# EAGLE design MegaShield (EAGLE 5.11)
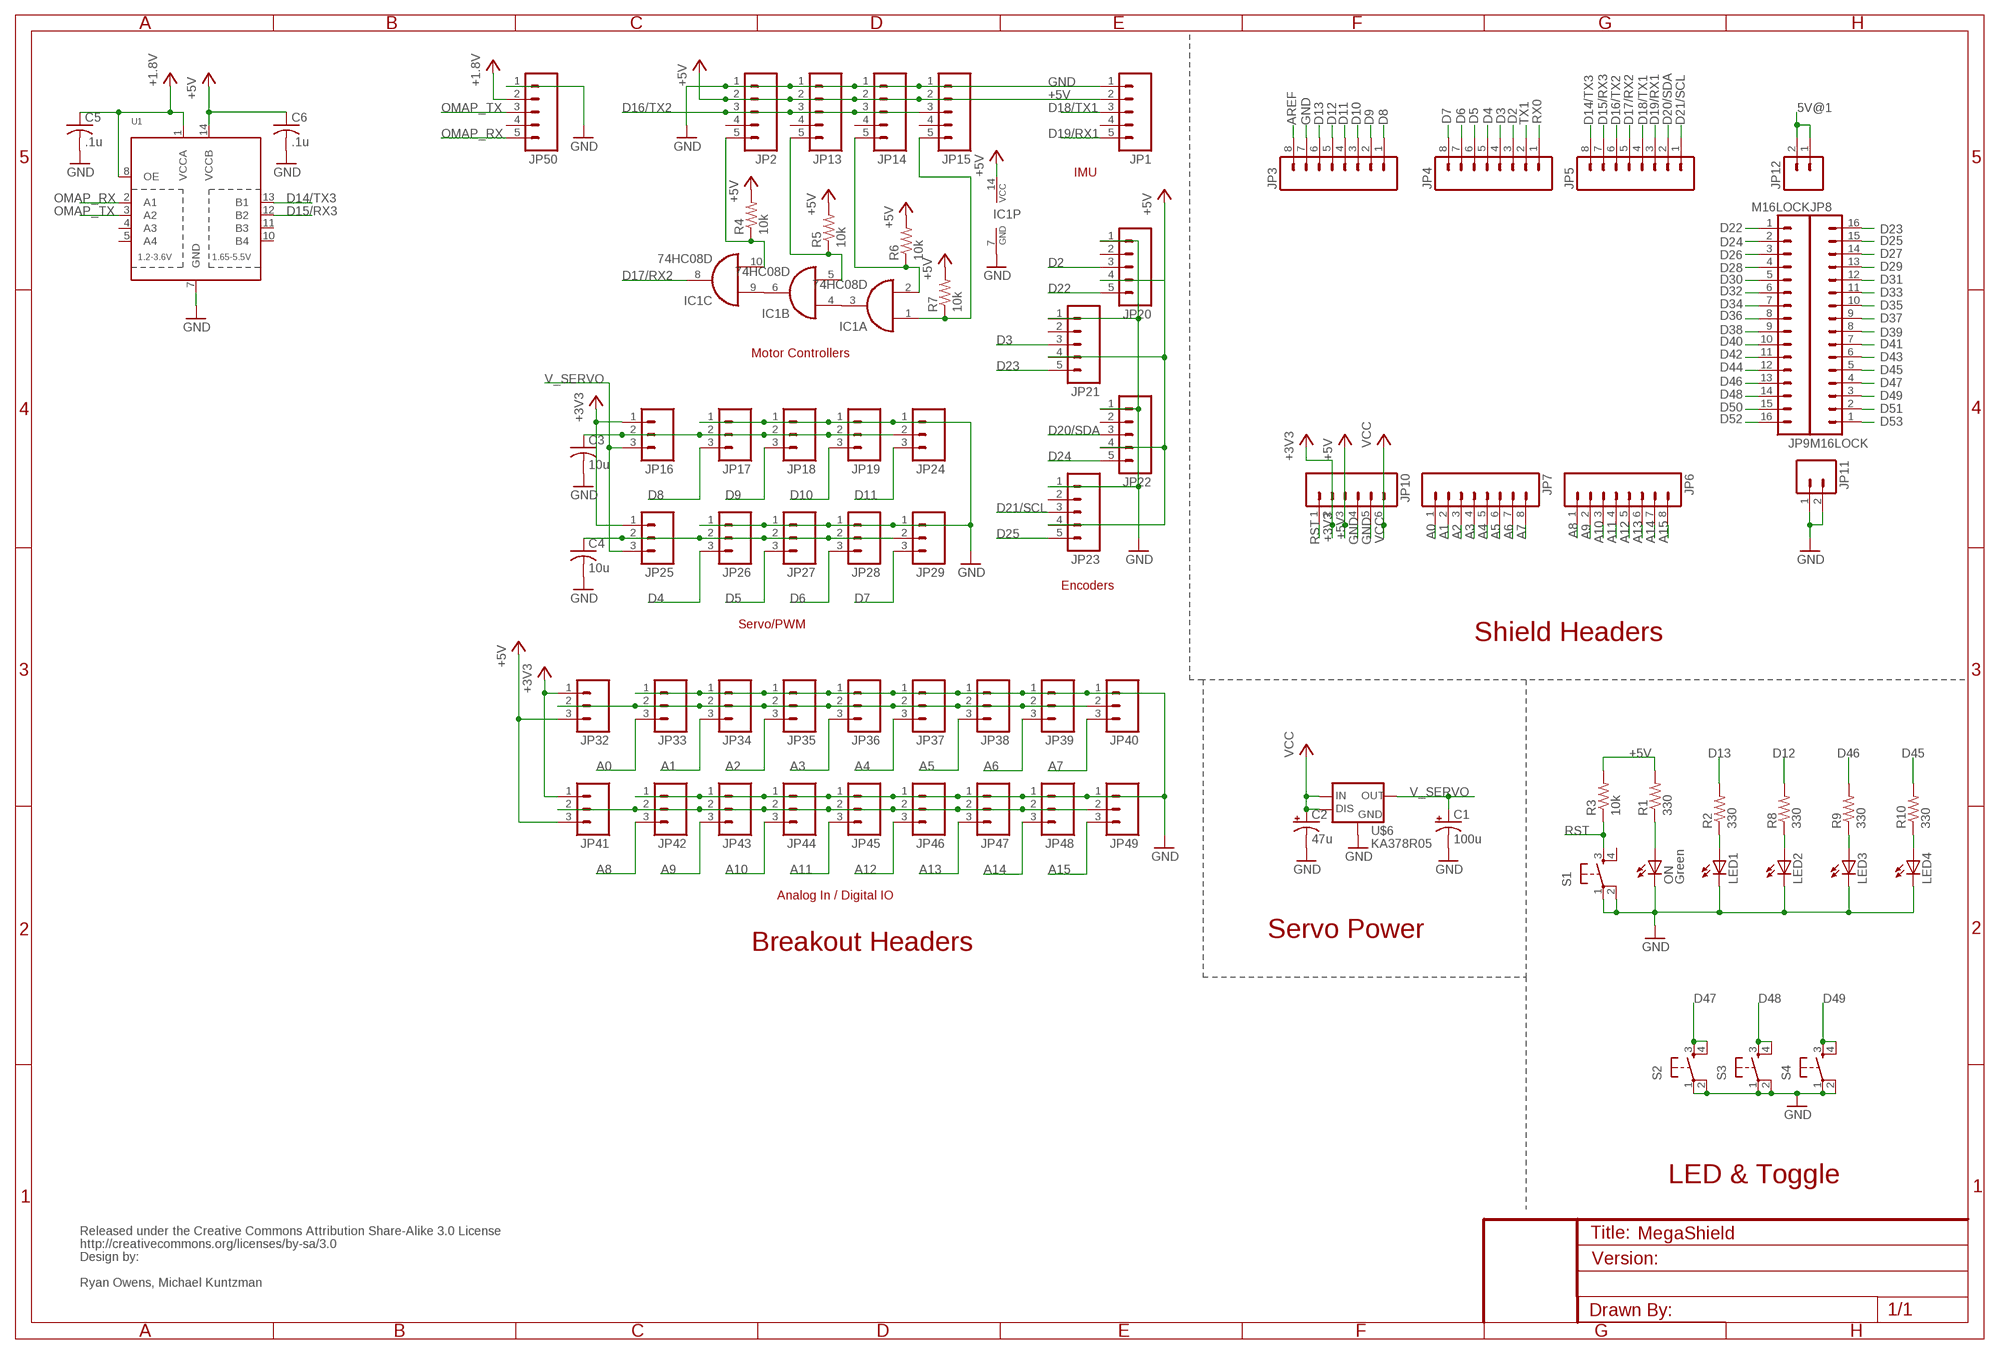
[diagram p0: schematic, sheet 1]

## Parts
C1  100u  CPOL-USC  [PANASONIC_C]
C2  47u  CPOL-USC  [PANASONIC_C]
C3  10u  C-USC0805  [C0805]
C4  10u  C-USC0805  [C0805]
C5  .1u  C-USC0805  [C0805]
C6  .1u  C-USC0805  [C0805]
IC1  74HC08D  [SO14]
JP1  M05LOCK  [1X05_LOCK]
JP2  M05PTH  [1X05]
JP3  M08LOCK  [1X08_LOCK]
JP4  M08LOCK  [1X08_LOCK]
JP5  M08LOCK  [1X08_LOCK]
JP6  M08LOCK  [1X08_LOCK]
JP7  M08LOCK  [1X08_LOCK]
JP8  M16LOCK  [1X16_LOCK]
JP9  M16LOCK  [1X16_LOCK]
JP10  M06LOCK  [1X06_LOCK]
JP11  M02LOCK  [1X02_LOCK]
JP12  M02LOCK  [1X02_LOCK]
JP13  M05PTH  [1X05]
JP14  M05PTH  [1X05]
JP15  M05PTH  [1X05]
JP16  M03PTH  [1X03]
JP17  M03PTH  [1X03]
JP18  M03PTH  [1X03]
JP19  M03PTH  [1X03]
JP20  M05PTH  [1X05]
JP21  M05PTH  [1X05]
JP22  M05PTH  [1X05]
JP23  M05PTH  [1X05]
JP24  M03PTH  [1X03]
JP25  M03PTH  [1X03]
JP26  M03PTH  [1X03]
JP27  M03PTH  [1X03]
JP28  M03PTH  [1X03]
JP29  M03PTH  [1X03]
JP32  M03PTH  [1X03]
JP33  M03PTH  [1X03]
JP34  M03PTH  [1X03]
JP35  M03PTH  [1X03]
JP36  M03PTH  [1X03]
JP37  M03PTH  [1X03]
JP38  M03PTH  [1X03]
JP39  M03PTH  [1X03]
JP40  M03PTH  [1X03]
JP41  M03PTH  [1X03]
JP42  M03PTH  [1X03]
JP43  M03PTH  [1X03]
JP44  M03PTH  [1X03]
JP45  M03PTH  [1X03]
JP46  M03PTH  [1X03]
JP47  M03PTH  [1X03]
JP48  M03PTH  [1X03]
JP49  M03PTH  [1X03]
JP50  M05LOCK  [1X05_LOCK]
LED1  LED0603  [LED-0603]
LED2  LED0603  [LED-0603]
LED3  LED0603  [LED-0603]
LED4  LED0603  [LED-0603]
ON  Green  LED0603  [LED-0603]
R1  330  R-US_R0805  [R0805]
R2  330  R-US_R0805  [R0805]
R3  10k  R-US_R0805  [R0805]
R4  10k  R-US_R0805  [R0805]
R5  10k  R-US_R0805  [R0805]
R6  10k  R-US_R0805  [R0805]
R7  10k  R-US_R0805  [R0805]
R8  330  R-US_R0805  [R0805]
R9  330  R-US_R0805  [R0805]
R10  330  R-US_R0805  [R0805]
S1  TAC_SWITCHPTH  [TACTILE-PTH]
S2  TAC_SWITCHPTH  [TACTILE-PTH]
S3  TAC_SWITCHPTH  [TACTILE-PTH]
S4  TAC_SWITCHPTH  [TACTILE-PTH]
U1  TXB0104PWR  [TSSOP14]
U$2  CREATIVE_COMMONS  [CREATIVE_COMMONS]
U$6  KA378R05  [KA378]

## Nets
5V@1: JP12.1 JP12.2
+1V8: C5.1 JP50.2 U1.1(VCCA) U1.8(OE) ; supply symbol labelled +1.8V
+3.3V: C6.1 U1.14(VCCB) ; supply symbol labelled +5V
+3V3 [power]: JP10.2 JP16.1 JP25.1 JP32.1 JP41.1
+5V [power]: IC1.14(P:VCC) JP1.2 JP2.2 JP10.3 JP13.2 JP14.2 JP15.2 JP20.4 JP21.4 JP22.4 JP23.4 JP32.3 JP41.3 R1.2 R3.2 R4.2 R5.2 R6.2 R7.2
A0: JP7.1 JP33.3
A1: JP7.2 JP34.3
A2: JP7.3 JP35.3
A3: JP7.4 JP36.3
A4: JP7.5 JP37.3
A5: JP7.6 JP38.3
A6: JP7.7 JP39.3
A7: JP7.8 JP40.3
A8: JP6.1 JP42.3
A9: JP6.2 JP43.3
A10: JP6.3 JP44.3
A11: JP6.4 JP45.3
A12: JP6.5 JP46.3
A13: JP6.6 JP47.3
A14: JP6.7 JP48.3
A15: JP6.8 JP49.3
AREF: JP3.8
D2: JP4.3 JP20.3
D3: JP4.4 JP21.3
D4: JP4.5 JP26.3
D5: JP4.6 JP27.3
D6: JP4.7 JP28.3
D7: JP4.8 JP29.3
D8: JP3.1 JP17.3
D9: JP3.2 JP18.3
D10: JP3.3 JP19.3
D11: JP3.4 JP24.3
D12: JP3.5 R8.2
D13: JP3.6 R2.2
D14/TX3: JP5.8 U1.13(B1)
D15/RX3: JP5.7 U1.12(B2)
D16/TX2: JP2.3 JP5.6 JP13.3 JP14.3 JP15.3
D17/RX2: IC1.8(C:O) JP5.5
D18/TX1: JP1.3 JP5.4
D19/RX1: JP1.5 JP5.3
D20/SDA: JP5.2 JP22.3
D21/SCL: JP5.1 JP23.3
D22: JP9.1 JP20.5
D23: JP8.16 JP21.5
D24: JP9.2 JP22.5
D25: JP8.15 JP23.5
D26: JP9.3
D27: JP8.14
D28: JP9.4
D29: JP8.13
D30: JP9.5
D31: JP8.12
D32: JP9.6
D33: JP8.11
D34: JP9.7
D35: JP8.10
D36: JP9.8
D37: JP8.9
D38: JP9.9
D39: JP8.8
D40: JP9.10
D41: JP8.7
D42: JP9.11
D43: JP8.6
D44: JP9.12
D45: JP8.5 R10.2
D46: JP9.13 R9.2
D47: JP8.4 S2.3 S2.4
D48: JP9.14 S3.3 S3.4
D49: JP8.3 S4.3 S4.4
D50: JP9.15
D51: JP8.2
D52: JP9.16
D53: JP8.1
GND [power]: C1.- C2.- C3.2 C4.2 C5.2 C6.2 IC1.7(P:GND) JP1.1 JP2.1 JP3.7 JP10.4 JP10.5 JP11.1 JP11.2 JP13.1 JP14.1 JP15.1 JP17.1 JP18.1 JP19.1 JP20.1 JP21.1 JP22.1 JP23.1 JP24.1 JP26.1 JP27.1 JP28.1 JP29.1 JP33.1 JP34.1 JP35.1 JP36.1 JP37.1 JP38.1 JP39.1 JP40.1 JP42.1 JP43.1 JP44.1 JP45.1 JP46.1 JP47.1 JP48.1 JP49.1 JP50.1 LED1.C LED2.C LED3.C LED4.C ON.C S1.1 S1.2 S2.1 S2.2 S3.1 S3.2 S4.1 S4.2 U1.7(GND) U$6.GND
N$1: LED2.A R8.1
N$2: C3.1 JP16.2 JP17.2 JP18.2 JP19.2 JP24.2
N$3: C4.1 JP25.2 JP26.2 JP27.2 JP28.2 JP29.2
N$4: IC1.3(A:O) IC1.4(B:I0)
N$5: IC1.6(B:O) IC1.9(C:I0)
N$6: IC1.1(A:I0) JP15.5 R7.1
N$7: IC1.2(A:I1) JP14.5 R6.1
N$8: IC1.5(B:I1) JP13.5 R5.1
N$9: IC1.10(C:I1) JP2.5 R4.1
N$10: JP41.2 JP42.2 JP43.2 JP44.2 JP45.2 JP46.2 JP47.2 JP48.2 JP49.2
N$11: JP32.2 JP33.2 JP34.2 JP35.2 JP36.2 JP37.2 JP38.2 JP39.2 JP40.2
N$12: LED3.A R9.1
N$13: LED4.A R10.1
N$126: ON.A R1.1
N$127: LED1.A R2.1
OMAP_RX: JP50.5 U1.2(A1)
OMAP_TX: JP50.3 U1.3(A2)
RST: JP10.1 R3.1 S1.3
RX0: JP4.1
TX1: JP4.2
V_SERVO [power]: C1.+ JP16.3 JP25.3 U$6.OUT
VCC [power]: C2.+ JP10.6 U$6.DIS U$6.IN
Unconnected: IC1.11(D:O) IC1.12(D:I0) IC1.13(D:I1) JP1.4 JP2.4 JP13.4 JP14.4 JP15.4 JP20.2 JP21.2 JP22.2 JP23.2 JP50.4 S1.4 U1.4(A3) U1.5(A4) U1.10(B4) U1.11(B3)

## Notes on the sheet
- IMU
- Motor Controllers
- Encoders
- Servo/PWM
- Shield Headers
- Analog In / Digital IO
- Servo Power
- Breakout Headers
- LED & Toggle
- Ryan Owens, Michael Kuntzman

## Library data of the parts
C1 C2 = resistor:CPOL-US: POLARIZED CAPACITOR, American symbol
C3-C6 = resistor:C-US: CAPACITOR, American symbol
IC1 = 74xx-eu:74*08: Quad 2-input AND gate
JP1 JP2 JP13-JP15 JP20-JP23 JP50 = SparkFun:M05: Header 5 Standard 5-pin 0.1" header. Use with straight break away headers (SKU : PRT-00116), right angle break away headers (PRT-00553), swiss pins (PRT-00743), machine pins (PRT-00117), and female headers (PRT-00115). Molex polarized connector foot print use with SKU : PRT-08230 with associated crimp pins and housings.
JP3-JP7 = SparkFun:M08: Header 8 Standard 8-pin 0.1" header. Use with straight break away headers (SKU : PRT-00116), right angle break away headers (PRT-00553), swiss pins (PRT-00743), machine pins (PRT-00117), and female headers (PRT-00115).
JP8 JP9 = SparkFun:M16
JP10 = SparkFun:M06: Header 6 Standard 6-pin 0.1" header. Use with straight break away headers (SKU : PRT-00116), right angle break away headers (PRT-00553), swiss pins (PRT-00743), machine pins (PRT-00117), and female headers (PRT-00115). Molex polarized connector foot print use with SKU : PRT-08094 with associated crimp pins and housings. NOTES ON THE VARIANTS LOCK and LOCK_LONGPADS... This footprint was designed to help hold the alignment of a through-hole component (i.e. 6-pin header) while soldering it into place. You may notice that each hole has been shifted either up or down by 0.005 of an inch from it's more standard position (which is a perfectly straight line). This slight alteration caused the pins (the squares in the middle) to touch the edges of the holes. Because they are alternating, it causes a "brace" to hold the component in place. 0.005 has proven to be the perfect amount of "off-center" position when using our standard breakaway headers. Although looks a little odd when you look at the bare footprint, once you have a header in there, the alteration is very hard to notice. Also, if you push a header all the way into place, it is covered up entirely on the bottom side. This idea of altering the position of holes to aid alignment will be further integrated into the Sparkfun Library for other footprints. It can help hold any component with 3 or more connection pins.
JP11 JP12 = SparkFun:M02: Header 2 Standard 2-pin 0.1" header. Use with straight break away headers (SKU : PRT-00116), right angle break away headers (PRT-00553), swiss pins (PRT-00743), machine pins (PRT-00117), and female headers (PRT-00115). Molex polarized connector foot print use with SKU : PRT-08233 with associated crimp pins and housings.
JP16-JP19 JP24-JP29 JP32-JP49 = SparkFun:M03: Header 3 Standard 3-pin 0.1" header. Use with straight break away headers (SKU : PRT-00116), right angle break away headers (PRT-00553), swiss pins (PRT-00743), machine pins (PRT-00117), and female headers (PRT-00115). Molex polarized connector foot print use with SKU : PRT-08232 with associated crimp pins and housings.
LED1-LED4 ON = SparkFun:LED: LEDs Standard schematic elements and footprints for 5mm, 3mm, 1206, and 0603 sized LEDs. 5mm - Spark Fun Electronics SKU : COM-00529 (and others)
R1-R10 = resistor:R-US_: RESISTOR, American symbol
S1-S4 = SparkFun:TAC_SWITCH: Momentary Switch Button commonly used for reset or general input. Spark Fun Electronics SKU : COM-00097
U1 = adafruit:TXB0104PWR: 4-Bit Bi-Directional Level Shifter 1.2V-3.6V (VCCA) to 1.65V-5.5V (VCCB) bi-directional level shifter with auto direction sensing. Max data rate - VCCA 1.8V: 20Mbps (50ns), VCCA 3.3V: 100Mbps (10ns) Digikey: 296-21929-1-ND
U$2 = SparkFun:CREATIVE_COMMONS
U$6 = ee192:KA378R05

## Board
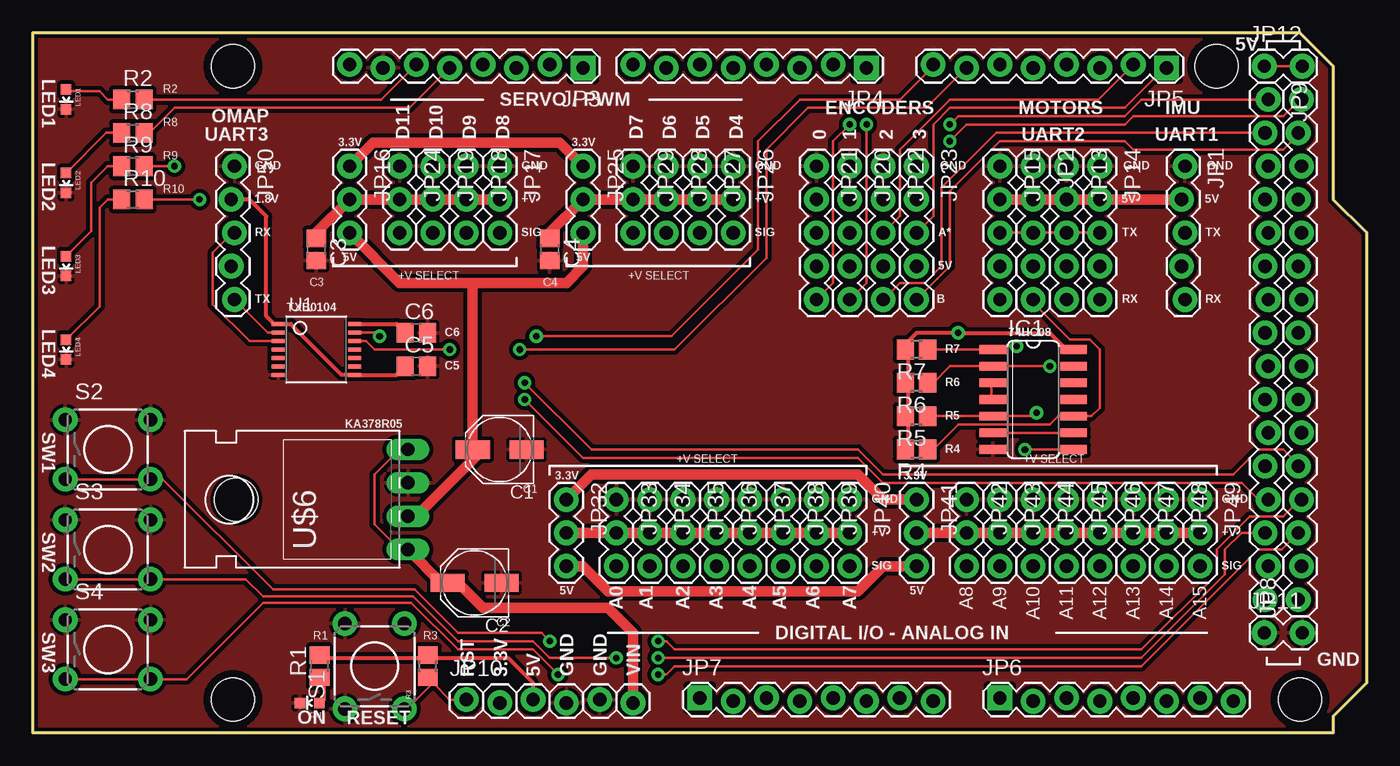
[diagram p1: board, top side]
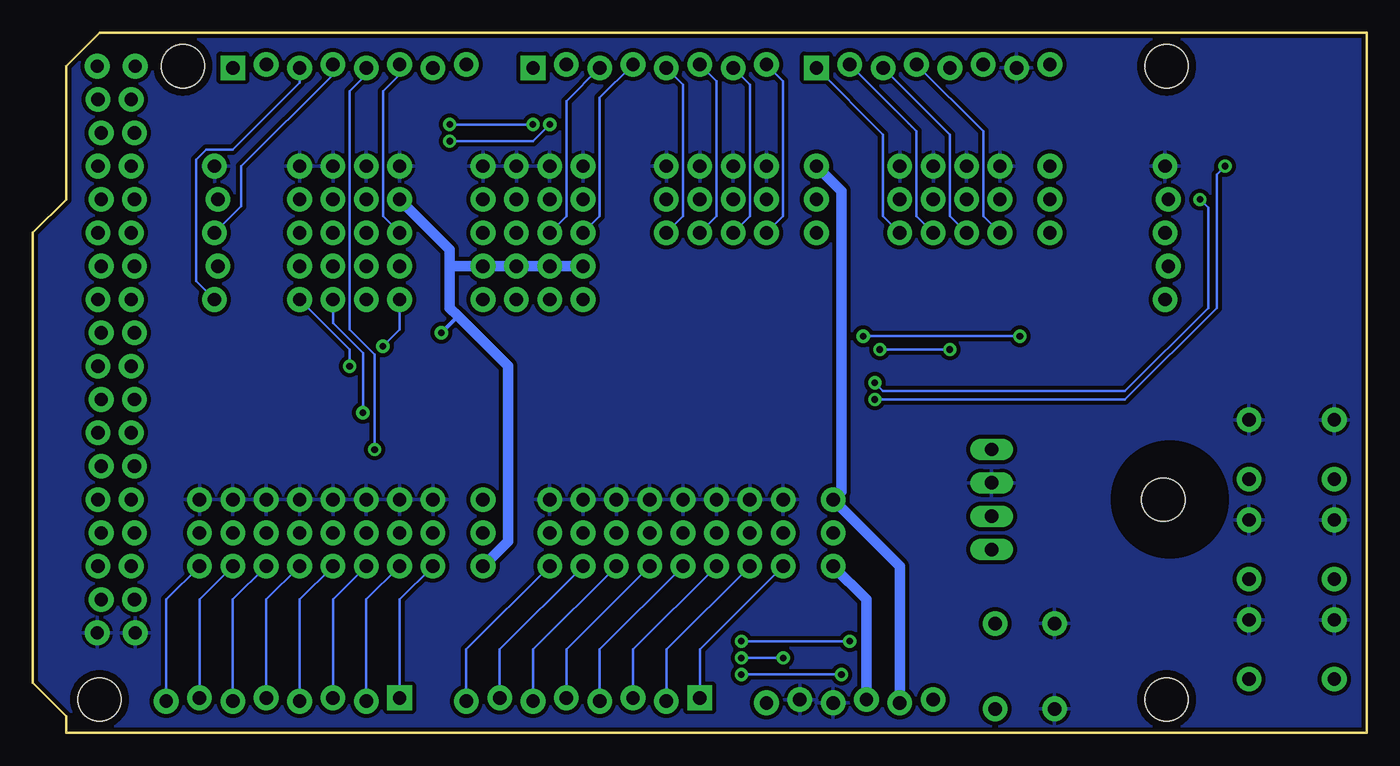
[diagram p2: board, bottom side, seen from below]

Size 101.6 x 53.34 mm. Coordinates in mm from the lower left corner, seen from the top.
Outline: 0,0 99.06,0 99.06,1.27 101.6,3.81 101.6,38.1 99.06,40.64 99.06,50.8 96.52,53.34 0,53.34 0,0
Copper layers (1*16): Top 0.035mm / dielectric 1.5mm / Bottom 0.035mm
Design rules "SparkFun *": minimum track width 8mil, minimum drill 15mil, track to track 8mil, track to pad 8mil, pad to pad 8mil, via to via 8mil, smd to smd 8mil, copper to edge 8mil, drill to drill 8mil, minimum pad ring 12mil, minimum via ring 10mil, stop-mask expansion 4mil, vias tented up to drill 25mil, thermal gap 10mil

### Footprints (pad centres in the part's own frame; a part is rotated, then mirrored left to right if it is on the bottom)
PANASONIC_C = smd 2.6 x 1.4: + 2.05,0; - -2.05,0
C0805 = smd 1.3 x 1.5: 1 -0.85,0; 2 0.85,0
SO14 = smd 0.66 x 2.032: 1 -3.81,-3.073; 2 -2.54,-3.073; 3 -1.27,-3.073; 4 0,-3.073; 5 1.27,-3.073; 6 2.54,-3.073; 7 3.81,-3.073; 8 3.81,3.073; 9 2.54,3.073; 10 1.27,3.073; 11 0,3.073; 12 -1.27,3.073; 13 -2.54,3.073; 14 -3.81,3.073
1X05_LOCK = drill 1.016 pad 1.88 round: 1 0,0.127; 2 2.54,-0.127; 3 5.08,0.127; 4 7.62,-0.127; 5 10.16,0.127
1X05 = drill 1.016 pad 1.88 round: 1 0,0; 2 2.54,0; 3 5.08,0; 4 7.62,0; 5 10.16,0
1X08_LOCK = drill 1.016 pad 1.88 square: 1 0,0.127 | drill 1.016 pad 1.88 round: 2 2.54,-0.127; 3 5.08,0.127; 4 7.62,-0.127; 5 10.16,0.127; 6 12.7,-0.127; 7 15.24,0.127; 8 17.78,-0.127
1X16_LOCK = drill 1.016 pad 1.88 round: 1 0,0.127; 2 2.54,-0.127; 3 5.08,0.127; 4 7.62,-0.127; 5 10.16,0.127; 6 12.7,-0.127; 7 15.24,0.127; 8 17.78,-0.127; 9 20.32,0.127; 10 22.86,-0.127; 11 25.4,0.127; 12 27.94,-0.127; 13 30.48,0.127; 14 33.02,-0.127; 15 35.56,0.127; 16 38.1,-0.127
1X06_LOCK = drill 1.016 pad 1.88 round: 1 0,0; 2 2.54,-0.254; 3 5.08,0; 4 7.62,-0.254; 5 10.16,0; 6 12.7,-0.254
1X02_LOCK = drill 1.016 pad 1.88 round: 1 -0.178,0; 2 2.718,0
1X03 = drill 1.016 pad 1.88 round: 1 0,0; 2 2.54,0; 3 5.08,0
LED-0603 = smd 0.8 x 0.8: A 0,-0.75; C 0,0.75
R0805 = smd 1.3 x 1.5: 1 -0.85,0; 2 0.85,0
TACTILE-PTH = drill 1.016 pad 1.88 round: 1 -3.251,2.261; 2 3.251,2.261; 3 -3.251,-2.261; 4 3.251,-2.261
TSSOP14 = smd 0.305 x 0.991: 1 -1.95,-2.918; 2 -1.3,-2.918; 3 -0.65,-2.918; 4 0,-2.918; 5 0.65,-2.918; 6 1.3,-2.918; 7 1.95,-2.918; 8 1.95,2.918; 9 1.3,2.918; 10 0.65,2.918; 11 0,2.918; 12 -0.65,2.918; 13 -1.3,2.918; 14 -1.95,2.918
STAND-OFF = hole 3.302: 0,0
KA378 = drill 1.016 long: DIS 3.81,-1.905; GND 1.27,-1.905; IN -3.81,-1.905; OUT -1.27,-1.905 | hole 3.302: 0,11.176

### Placement (x,y rotation side)
C1  35.56,21.59 180 top
C2  33.66,11.43 180 top
C3  21.59,36.83 270 top
C4  39.37,36.83 270 top
C5  29.21,27.94 0 top
C6  29.21,30.48 0 top
IC1  76.2,25.4 270 top
JP1  87.63,43.18 270 top
JP2  76.2,43.18 270 top
JP3  41.91,50.8 180 top
JP4  63.5,50.8 180 top
JP5  86.36,50.8 180 top
JP6  73.66,2.54 0 top
JP7  50.8,2.54 0 top
JP8  96.52,10.16 90 top
JP9  93.98,48.26 270 top
JP10  33.02,2.54 0 top
JP11  93.98,7.62 0 top
JP12  93.98,50.8 0 top
JP13  78.74,43.18 270 top
JP14  81.28,43.18 270 top
JP15  73.66,43.18 270 top
JP16  24.13,43.18 270 top
JP17  35.56,43.18 270 top
JP18  33.02,43.18 270 top
JP19  30.48,43.18 270 top
JP20  62.23,43.18 270 top
JP21  59.69,43.18 270 top
JP22  64.77,43.18 270 top
JP23  67.31,43.18 270 top
JP24  27.94,43.18 270 top
JP25  41.91,43.18 270 top
JP26  53.34,43.18 270 top
JP27  50.8,43.18 270 top
JP28  48.26,43.18 270 top
JP29  45.72,43.18 270 top
JP32  40.64,17.78 270 top
JP33  44.45,17.78 270 top
JP34  46.99,17.78 270 top
JP35  49.53,17.78 270 top
JP36  52.07,17.78 270 top
JP37  54.61,17.78 270 top
JP38  57.15,17.78 270 top
JP39  59.69,17.78 270 top
JP40  62.23,17.78 270 top
JP41  67.31,17.78 270 top
JP42  71.12,17.78 270 top
JP43  73.66,17.78 270 top
JP44  76.2,17.78 270 top
JP45  78.74,17.78 270 top
JP46  81.28,17.78 270 top
JP47  83.82,17.78 270 top
JP48  86.36,17.78 270 top
JP49  88.9,17.78 270 top
JP50  15.24,43.18 270 top
LED1  2.54,48.26 180 top
LED2  2.54,41.91 180 top
LED3  2.54,35.56 180 top
LED4  2.54,29.21 180 top
ON  21.08,2.29 90 top
R1  21.84,5.08 90 top
R2  7.62,48.26 0 top
R3  30.1,5.08 90 top
R4  67.31,21.59 180 top
R5  67.31,24.13 180 top
R6  67.31,26.67 180 top
R7  67.31,29.21 180 top
R8  7.62,45.72 0 top
R9  7.62,43.18 0 top
R10  7.62,40.64 0 top
S1  26.04,5.08 90 top
S2  5.71,21.59 0 top
S3  5.71,13.97 0 top
S4  5.71,6.35 0 top
U1  21.59,29.21 270 top
U$1  [STAND-OFF]  15.24,2.54 0 top
U$2  20.32,-7.62 0 top  (outside the outline)
U$3  [STAND-OFF]  15.24,50.8 0 top
U$4  [STAND-OFF]  90.17,50.8 0 top
U$5  [STAND-OFF]  96.52,2.54 0 top
U$6  26.67,17.78 90 top

### Tracks (layer width: path | path; a pad name or v marks a point on that pad's centre or on a via)
5V@1
  Top 0.203: JP12.1 JP12.2
+1V8
  Top 0.305: C5.1 27.68,27.26 U1.8 24.46,27.3 23.5,27.3 19.64,31.16 U1.1 18.37,31.16 17.78,31.75 17.78,39.37 16.51,40.64 JP50.2
+3.3V
  Top 0.305: U1.14 27.68,31.16 C6.1
+3V3
  Top 0.813: JP16.1 25.91,44.96 40.13,44.96 JP25.1 | JP32.1 42.55,19.68 62.87,19.68 64.77,17.78 JP41.1
  Bottom 0.813: JP10.2 35.56,12.7 JP32.1 40.01,18.41 40.01,41.27 JP25.1
+5V  (via drill 0.51)
  Top 0.305: R1.2 22.23,5.71 29.84,5.71 R3.2 30.48,5.71 36.2,5.71 38.1,3.81 JP10.3 | 66.67,24.13 66.67,21.59 R4.2 | 66.67,26.67 66.67,29.21 R7.2 66.04,29.21 67.31,30.48 v70.48,30.48 77.47,30.48 78.74,29.21 IC1.14 | 66.67,26.67 66.67,24.13 | 66.67,24.13 R5.2 | 66.67,26.67 R6.2
  Top 0.813: JP15.2 JP2.2 JP13.2 JP14.2 JP1.2 | JP32.3 41.91,12.7 43.81,10.79 62.87,10.79 64.77,12.7 JP41.3
  Bottom 0.305: 69.22,31.75 v70.48,30.48
  Bottom 0.813: JP10.3 38.1,10.16 JP32.3 | JP21.4 JP20.4 JP22.4 JP23.4 69.85,35.56 | JP41.3 65.41,14.61 65.41,27.94 69.22,31.75 69.85,32.38 69.85,35.56 | JP15.2 69.85,36.83 69.85,35.56
A0
  Bottom 0.203: JP33.3 50.8,6.35 JP7.1
A1
  Bottom 0.203: JP34.3 53.34,6.35 JP7.2
A2
  Bottom 0.203: JP35.3 55.88,6.35 JP7.3
A3
  Bottom 0.203: JP36.3 58.42,6.35 JP7.4
A4
  Bottom 0.203: JP37.3 60.96,6.35 JP7.5
A5
  Bottom 0.203: JP38.3 63.5,6.35 JP7.6
A6
  Bottom 0.203: JP39.3 66.04,6.35 JP7.7
A7
  Bottom 0.203: JP40.3 68.58,6.35 JP7.8
A8
  Bottom 0.203: JP42.3 73.66,10.16 JP6.1
A9
  Bottom 0.203: JP43.3 76.2,10.16 JP6.2
A10
  Bottom 0.203: JP6.3 78.74,10.16 JP44.3
A11
  Bottom 0.203: JP6.4 81.28,10.16 JP45.3
A12
  Bottom 0.203: JP6.5 83.82,10.16 JP46.3
A13
  Bottom 0.203: JP6.6 86.36,10.16 JP47.3
A14
  Bottom 0.203: JP6.7 88.9,10.16 JP48.3
A15
  Bottom 0.203: JP6.8 91.44,10.16 JP49.3
D2
  Bottom 0.203: JP4.3 60.96,48.13 60.96,39.37 JP20.3
D3
  Bottom 0.203: JP4.4 58.42,48.39 58.42,39.37 JP21.3
D4
  Bottom 0.203: JP26.3 52.07,39.37 52.07,49.4 JP4.5
D5
  Bottom 0.203: JP27.3 49.53,39.37 49.53,49.66 JP4.6
D6
  Bottom 0.203: JP28.3 46.99,39.37 46.99,49.4 JP4.7
D7
  Bottom 0.203: JP29.3 44.45,39.37 44.45,49.66 JP4.8
D8
  Bottom 0.203: JP17.3 36.83,39.37 36.83,45.59 JP3.1
  Bottom 0.254: JP3.1 41.78,50.67
D9
  Bottom 0.203: JP18.3 34.29,39.37 34.29,45.85 JP3.2
D10
  Bottom 0.203: JP19.3 31.75,39.37 31.75,45.59 JP3.3
D11
  Bottom 0.203: JP24.3 29.21,39.37 29.21,45.85 JP3.4
D12
  Top 0.203: R8.2 8.89,45.72 10.79,47.62 28.7,47.62 JP3.5
D13
  Top 0.203: R2.2 26.54,48.26 JP3.6
D14/TX3  (via drill 0.5)
  Top 0.203: U1.13 26.13,30.51 v26.42,30.23 | JP5.8 68.58,50.8 66.04,48.26 58.42,48.26 55.24,45.09 55.24,36.83 48.64,30.23 v38.35,30.23
  Bottom 0.203: v26.42,30.23 v38.35,30.23
D15/RX3  (via drill 0.5)
  Top 0.203: U1.12 25.39,29.86 26.04,29.21 v31.75,29.21 | v37.08,29.21 48.9,29.21 55.88,36.2 55.88,44.45 59.05,47.62 68.07,47.62 JP5.7
  Bottom 0.203: v31.75,29.21 v37.08,29.21
D16/TX2
  Top 0.203: JP15.3 JP2.3 JP13.3 JP14.3
  Bottom 0.203: JP5.6 73.66,50.16 74.93,48.9 74.93,39.37 JP15.3
D17/RX2  (via drill 0.5)
  Top 0.203: v75.56,21.59 IC1.8
  Bottom 0.203: JP5.5 76.2,50.16 77.47,48.9 77.47,30.73 75.56,28.83 v75.56,21.59
D18/TX1
  Bottom 0.203: JP5.4 78.74,50.16 85.72,43.18 85.72,40.13 JP1.3
D19/RX1
  Bottom 0.203: JP5.3 81.28,49.53 86.36,44.45 88.39,44.45 89.15,43.69 89.15,34.42 JP1.5
D20/SDA
  Top 0.203: JP5.2 81.15,48.26 69.85,48.26 66.04,44.45 66.04,39.37 JP22.3
D21/SCL
  Top 0.203: JP5.1 86.23,50.67 83.19,47.62 69.85,47.62 68.58,46.35 68.58,39.37 JP23.3
D22  (via drill 0.5)
  Top 0.203: JP20.5 63.5,34.29 v63.5,46.35 | JP9.1 84.45,48.26 83.19,46.99 70.48,46.99 v69.85,46.35
  Bottom 0.203: v63.5,46.35 v69.85,46.35
D23  (via drill 0.5)
  Top 0.203: JP8.16 96.52,48.26 95.25,46.99 83.82,46.99 83.19,46.35 71.12,46.35 v69.85,45.09 | v62.23,46.35 60.96,45.09 60.96,34.29 JP21.5
  Bottom 0.203: v69.85,45.09 63.5,45.09 v62.23,46.35
D24
  Top 0.203: JP22.5 66.04,34.29 67.94,34.29 69.22,35.56 69.22,41.53 73.41,45.72 JP9.2
D25
  Top 0.203: JP8.15 96.39,45.59 95.25,44.45 83.82,44.45 83.19,45.09 73.66,45.09 69.85,41.27 69.85,35.56 69.22,34.92 68.9,34.61 JP23.5
D45  (via drill 0.5)
  Top 0.203: JP8.5 96.39,20.45 95.25,21.59 93.34,21.59 91.44,19.68 64.77,19.68 62.87,21.59 42.55,21.59 v37.47,26.67 | v12.7,40.64 R10.2
  Bottom 0.203: v37.47,26.67 36.83,26.04 18.41,26.04 12.06,32.38 12.06,40.01 v12.7,40.64
D46  (via drill 0.5)
  Top 0.203: JP9.13 93.34,17.78 92.08,19.05 64.77,19.05 62.87,20.95 41.91,20.95 v37.47,25.4 | v10.79,43.18 R9.2
  Bottom 0.203: v37.47,25.4 18.41,25.4 11.43,32.38 11.43,42.55 v10.79,43.18
D47  (via drill 0.5)
  Top 0.203: S2.3 S2.4 9.88,19.33 18.29,10.92 29.08,10.92 32.38,7.62 38.73,7.62 v39.37,6.99 | v47.62,6.99 48.26,6.99 48.9,6.35 84.45,6.35 90.17,12.06 90.17,13.97 92.71,16.51 95.25,16.51 96.52,17.78 JP8.4
  Bottom 0.203: v39.37,6.99 v47.62,6.99
D48  (via drill 0.5)
  Top 0.203: S3.3 S3.4 16.23,11.71 17.53,10.41 28.96,10.41 32.38,6.99 38.1,6.99 39.37,5.71 v44.45,5.71 | JP9.14 92.08,15.24 90.81,13.97 90.81,12.06 84.45,5.71 v47.62,5.71
  Bottom 0.203: v44.45,5.71 v47.62,5.71
D49  (via drill 0.5)
  Top 0.203: S4.3 S4.4 11.71,4.09 17.53,9.91 28.83,9.91 32.38,6.35 38.1,6.35 v40.01,4.45 | v47.62,4.45 48.26,4.45 48.9,5.08 84.45,5.08 93.34,13.97 95.12,13.97 JP8.3
  Bottom 0.203: v40.01,4.45 v47.62,4.45
GND
  pour Bottom (isolate 0.305): 0,0 99.06,0 99.06,1.27 101.6,3.81 101.6,38.1 99.06,40.64 99.06,50.8 96.52,53.34 0,53.34 0,2.54
  pour Top (isolate 0.305): 0,0 99.06,0 99.06,1.27 101.6,3.81 101.6,38.1 99.06,40.64 99.06,50.8 96.52,53.34 0,53.34
N$1
  Top 0.203: R8.1 5.6,45.72 LED2.A
N$2
  Top 0.813: JP17.2 JP18.2 JP19.2 JP24.2 JP16.2 21.59,38.1 C3.1
N$3
  Top 0.813: JP26.2 JP27.2 JP28.2 JP29.2 JP25.2 39.37,38.1 C4.1
N$4
  Top 0.203: IC1.4 73.03,25.4 73.03,26.67 IC1.3
N$5
  Top 0.203: IC1.6 IC1.9
N$6  (via drill 0.5)
  Top 0.203: R7.1 IC1.1 73.66,29.21 73.91,29.46 v74.93,29.46
  Bottom 0.203: JP15.5 73.66,30.73 v74.93,29.46
N$7  (via drill 0.5)
  Top 0.203: R6.1 68.58,26.67 69.85,27.94 IC1.2 v77.47,27.94
  Bottom 0.203: JP14.5 77.47,29.21 v77.47,27.94
N$8  (via drill 0.5)
  Top 0.203: R5.1 IC1.5 76.2,24.13 v76.45,24.38
  Bottom 0.203: JP13.5 78.74,31.24 76.45,28.96 v76.45,24.38
N$9
  Top 0.203: R4.1 68.58,21.59 70.48,23.5 77.47,23.5 78.11,24.13 IC1.10 80.64,24.13 81.28,24.77 81.28,29.21 80.52,29.97 78.99,29.97 76.2,32.77 JP2.5
N$10
  Top 0.813: JP41.2 JP42.2 JP43.2 JP44.2 JP45.2 JP46.2 JP47.2 JP48.2 JP49.2
N$11
  Top 0.813: JP32.2 JP33.2 JP34.2 JP35.2 JP36.2 JP37.2 JP38.2 JP39.2 | JP39.2 60.96,15.24 | JP39.2 JP40.2
N$12
  Top 0.203: 2.54,36.2 LED3.A 4.45,38.22 4.45,41.91 5.71,43.18 R9.1
N$13
  Top 0.203: R10.1 5.71,40.64 5.08,40.01 5.08,32.5 LED4.A
N$126
  Top 0.203: ON.A 22.23,2.54 22.23,3.81 R1.1
N$127
  Top 0.203: R2.1 5.71,48.26 5.08,48.9 2.65,48.9 LED1.A
OMAP_RX
  Top 0.203: U1.2 17.88,30.51 JP50.5
OMAP_TX
  Top 0.203: JP50.3 15.24,38.1 13.72,36.58 13.72,32.64 16.51,29.84 18.66,29.84 U1.3
RST
  Top 0.203: 30.48,3.81 31.75,2.54 JP10.1 | 30.48,3.81 28.57,1.91 S1.3 | 30.48,3.81 R3.1
V_SERVO
  Top 0.813: U$6.OUT 29.21,16.51 34.29,21.59 C1.+ 33.51,34.15 33.66,34.29 | JP25.3 41.91,35.56 40.64,34.29 33.66,34.29 | 33.66,34.29 27.94,34.29 JP16.3
VCC
  Top 0.203: U$6.DIS 27.94,21.59 26.04,19.68 26.04,15.88 27.94,13.97 U$6.IN
  Top 0.813: U$6.IN 31.11,11.43 C2.+ 32.38,11.43 34.29,9.53 43.81,9.53 45.72,7.62 JP10.6

### Text on the board
tPlace: 5V | LED1 | R2 | SERVO / PWM | ENCODERS | MOTORS | IMU | R8 | OMAP | UART3 | 3.3V | D11 | D10 | D9 | D8 | 3.3V | D7 | D6 | D5 | D4 | 0 | 1 | 2 | 3 | UART2 | UART1 | R9 | LED2 | GND | GND | GND | GND | GND | GND | R10 | 1.8V | +V | +V | 5V | 5V | RX | SIG | SIG | A* | TX | TX | LED3 | 5V | 5V | +V SELECT | +V SELECT | 5V | C3 | C4 | TX | B | RX | RX | TXB0104 | LED4 | C6 | 74HC08 | R7 | C5 | R6 | R5 | SW1 | KA378R05 | +V SELECT | R4 | +V SELECT | 3.3V | 3.3V | C1 | GND | GND | SW2 | +V | +V | SIG | SIG | 5V | 5V | A0 | A1 | A2 | A3 | A4 | A5 | A6 | A7 | A8 | A9 | A10 | A11 | A12 | A13 | A14 | A15 | SW3 | C2 | R1 | R3 | DIGITAL I/O - ANALOG IN | GND | RST | 3.3V | 5V | GND | GND | VIN | ON | RESET